# EAGLE schematic Filter_Amp Circuit (EAGLE 9.6.2)
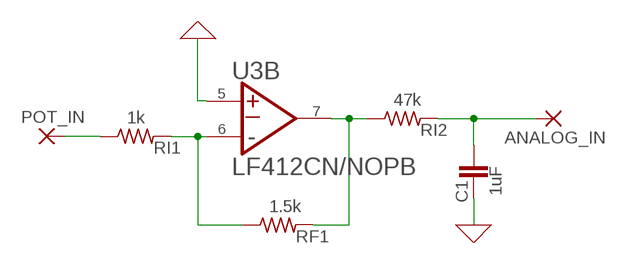
[diagram p0: schematic, sheet 1]

## Parts
ANALOG_IN  1,6/0,8  [1,6/0,8]
C1  1uF  C2,5-3  [C2.5-3]
POT_IN  1,6/0,8  [1,6/0,8]
RF1  1.5k  R-US_0309/10  [0309/10]
RI1  1k  R-US_0309/10  [0309/10]
RI2  47k  R-US_0309/10  [0309/10]
U3  TEXAS_INSTRUMENTS_LF412CN-NOPBTEXAS_INSTRUMENTS_LF412CN-NOPB_0_0  [TEXAS_INSTRUMENTS_LF412CN-NOPB_0]

## Nets
0: C1.2 U3.5(B:NON-INVERTING_INPUT_B) ; supply symbol labelled GND
N$1: POT_IN.1(P) RI1.1
N$2: RF1.2 RI2.1 U3.7(B:OUTPUT_B)
N$3: ANALOG_IN.1(P) C1.1 RI2.2
N$4: RF1.1 RI1.2 U3.6(B:INVERTING_INPUT_B)
Unconnected: U3.1(A:OUTPUT_A) U3.2(A:INVERTING_INPUT_A) U3.3(A:NON-INVERTING_INPUT_A)

## Power pins joined to a net without a drawn wire
V+: U3.8(A:V+)
V-: U3.4(A:V-)

## Library data of the parts
ANALOG_IN POT_IN = wirepad:1,6/0,8: THROUGH-HOLE PAD
C1 = capacitor-wima:C: CAPACITOR naming: grid - package width
RF1 RI1 RI2 = rcl:R-US_: RESISTOR, American symbol; SPICEPREFIX: R
U3 = NOPB:TEXAS_INSTRUMENTS_LF412CN-NOPB: Low Offset, Low Drift Dual JFET Input Operational Amplifier 8-PDIP 0 to 70; AUTOMOTIVE: No; CENTROID_NOT_SPECIFIED: No; DATASHEET: https://www.ti.com/lit/ds/symlink/lf412-n.pdf; DEVICE_CLASS_L1: Integrated Circuits (ICs); DEVICE_CLASS_L2: Linear ICs; DEVICE_CLASS_L3: Amplifiers - Op Amps; DIGIKEY_DESCRIPTION: IC OPAMP JFET 2 CIRCUIT 8DIP; DIGIKEY_PART_NUMBER: LF412CN/NOPB-ND; FOOTPRINT_PARAMETERS_0: {"fp_type":"DIP","params":{"N":{"nom":8,"long name":"Number of leads","min":null,"max":null,"short name":"N","type":"count"},"A":{"nom":false,"long name":"Height","min":false,"max":5080000,"short name":"A","type":"measurement"},"A1":{"nom":false,"long name":"Package clearance","min":510000,"max":false,"short name":"A1","type":"measurement"},"A2":{"nom":false,"long name":"Package height","min":false,"max":4570000,"short name":"A2","type":"measurement"},"D":{"nom":false,"long name":"Package length","min":false,"max":10160000,"short name":"D","type":"measurement"},"E":{"nom":false,"long name":"Width w/ leads","min":7620000,"max":8260000,"short name":"E","type":"measurement"},"E1":{"nom":false,"long name":"Package width","min":false,"max":6600000,"short name":"E1","type":"measurement"},"B":{"nom":false,"long name":"Lead width","min":380000,"max":530000,"short name":"B","type":"measurement"},"C":{"nom":250000,"long name":"Lead thickness","min":false,"max":false,"short name":"C","type":"measurement"},"e":{"nom":2540000,"long name":"Lead pitch","min":null,"max":null,"short name":"e","type":"measurement"},"offset x":{"nom":0,"long name":"X Center offset","min":null,"max":null,"short name":"offset x","type":"measurement"},"offset y":{"nom":0,"long name":"Y Center offset","min":null,"max":null,"short name":"offset y","type":"measurement"},"LS":{"default":"Circle","long name":"Land shape","type":"multichoice","short name":"LS"},"LS1":{"default":"Square","long name":"Land shape (Pin 1)","type":"multichoice","short name":"LS1"}}}; FOOTPRINT_VARIANT_NAME_0: Recommended_Land_Pattern; GAIN_BANDWIDTH: 4MHz; HEIGHT: 5.08mm; INPUT_BIAS_CURRENT: 0.00005uA; INPUT_OFFSET_VOLTAGE: 1mV; LEAD_FREE: Yes; MAX_DUAL_SUPPLY_VOLTAGE: 15V; MAX_JUNCTION_TEMP: +115°C; MF: Texas Instruments; MFG_PACKAGE_IDENT: P0008A; MFG_PACKAGE_IDENT_COMPONENT_ID: 14e3c34b0210167e; MFG_PACKAGE_IDENT_DATE: 0; MFG_PACKAGE_IDENT_REV: 0; MOUSER_DESCRIPTION: Operational Amplifiers - Op Amps LOW OFFSET,LOW DRIFT DUAL JFET INP OP AMP; MOUSER_PART_NUMBER: 926-LF412CN/NOPB; MPN: LF412CN/NOPB; NOMINAL_SUPPLY_CURRENT: 3.6mA; NUMBER_OF_CHANNELS: 2; PACKAGE: PDIP8; PREFIX: U; ROHS: Yes; STANDOFF_HEIGHT: 0.51mm; TEMPERATURE_RANGE_HIGH: +70°C; TEMPERATURE_RANGE_LOW: 0°C; VERIFICATION_VERSION: 0.0.0.3; VOLTAGE_GAIN: 200V/mV